# Altium project SoldeerStationProjectOntWerpen.PrjPcb
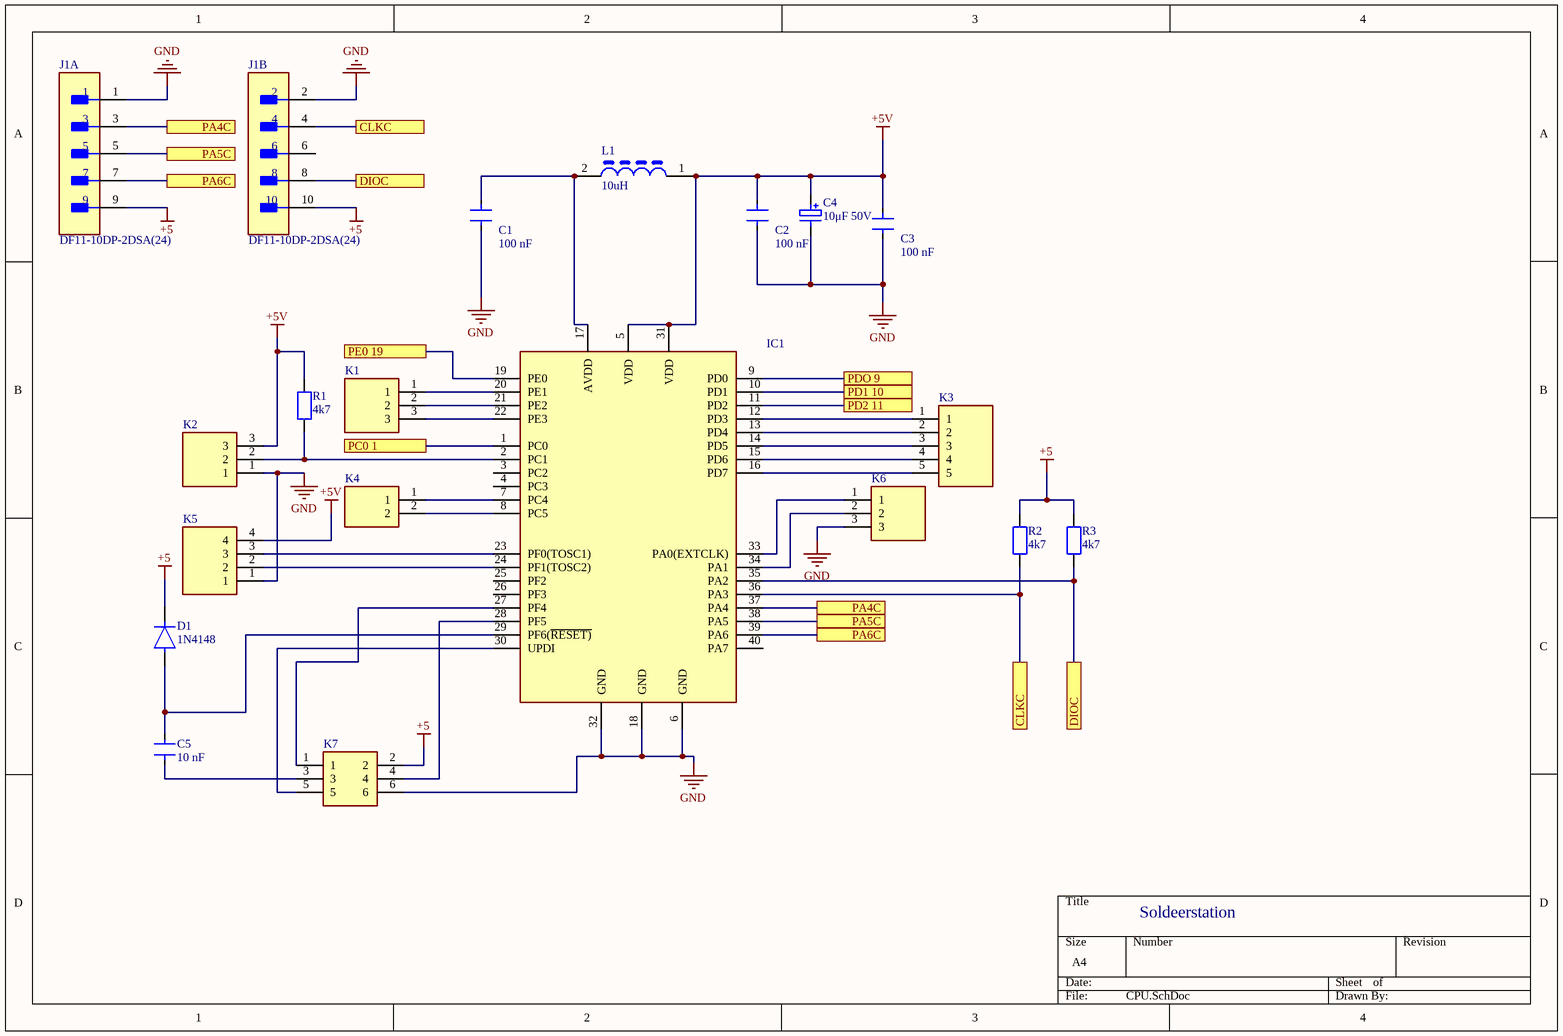
[diagram p0: CPU.SchDoc]
4 sheets, 69 parts. Net scope: flat (ports and power ports of the same name join across sheets).
Board file: PCB1.PcbDoc
Sheets:
  CPU.SchDoc
  Display.SchDoc
  Versterker.SchDoc
  Voeding.SchDoc

## Sheet CPU.SchDoc: Soldeerstation
size A4; Revision: 1; SheetNumber: 1; SheetTotal: 5

### Parts
C1  100 nF  [0805]
C2  100 nF  [0805]
C3  100 nF  [0805]
C4  10μF 50V  [Elco 10uF 50V]
C5  10 nF  [0805]
D1  1N4148  [1N4148]
IC1  ATMEGA4809-PF  [IC3]  (value not drawn)
J1  DF11-10DP-2DSA(24)  [FP-DF11-10DP-2DSA_24-MFG]  (parts A,B of 2)
K1  5-146280-3  [3 Pin Header]  (value not drawn)
K2  5-146280-3  [3 Pin Header]  (value not drawn)
K3  5-146280-5  [5 Pin Header]  (value not drawn)
K4  5-146280-2  [2 Pin Header]  (value not drawn)
K5  5-146280-4  [4 Pin Header]  (value not drawn)
K6  5-146280-3  [3 Pin Header]  (value not drawn)
K7  2x3 Pin Header  [2x3 Pin Header]  (value not drawn)
L1  10uH  [Smoorspoel]
R1  4k7  [Resistor]
R2  4k7  [Resistor]
R3  4k7  [Resistor]

### Ports
CLKC (see CPU[1A]), CLKC (see CPU[3C]), DIOC (see CPU[1A]), DIOC (see CPU[3C]), PA4C (see CPU[1A]), PA4C (see CPU[3C]), PA5C (see CPU[1A]), PA5C (see CPU[3C]), PA6C (see CPU[1A]), PA6C (see CPU[3C]), PC0 1 (see Regelaar[1B]), PD1 10 (see Versterker[1C]), PD2 11 (see Voeding[4B]), PDO 9 (see Versterker[1A]), PE0 19 (see Voeding[2B])

### Nets
+5: D1.1(C) J1.9 J1.10 K7.2 R2.2 R3.2
+5V: C2.1 C3.1 C4.1 IC1.5(VDD) IC1.31(VDD) K2.3 K5.4 L1.1 R1.2
GND: C1.2 C2.2 C3.2 C4.2 IC1.6(GND) IC1.18(GND) IC1.32(GND) J1.1 J1.2 K2.1 K5.1 K6.3 K7.6
NetC1_1: C1.1 IC1.17(AVDD) L1.2
NetC5_1: C5.1 K7.3
NetC5_2: C5.2 D1.2(A) IC1.29(PF6(~{RESET)})
NetC13_2: IC1.9(PD0) ; port PDO 9
NetC15_2: IC1.10(PD1) ; port PD1 10
NetIC1_1: IC1.1(PC0) ; port PC0 1
NetIC1_2: IC1.2(PC1) K2.2 R1.1
NetIC1_7: IC1.7(PC4) K4.1
NetIC1_8: IC1.8(PC5) K4.2
NetIC1_11: IC1.11(PD2) ; port PD2 11
NetIC1_12: IC1.12(PD3) K3.1
NetIC1_13: IC1.13(PD4) K3.2
NetIC1_14: IC1.14(PD5) K3.3
NetIC1_15: IC1.15(PD6) K3.4
NetIC1_16: IC1.16(PD7) K3.5
NetIC1_19: IC1.19(PE0) ; port PE0 19
NetIC1_20: IC1.20(PE1) K1.1
NetIC1_21: IC1.21(PE2) K1.2
NetIC1_22: IC1.22(PE3) K1.3
NetIC1_23: IC1.23(PF0(TOSC1)) K5.3
NetIC1_24: IC1.24(PF1(TOSC2)) K5.2
NetIC1_27: IC1.27(PF4) K7.1
NetIC1_28: IC1.28(PF5) K7.4
NetIC1_30: IC1.30(UPDI) K7.5
NetIC1_33: IC1.33(PA0(EXTCLK)) K6.1
NetIC1_34: IC1.34(PA1) K6.2
NetIC1_35: IC1.35(PA2) J1.8 R3.1 ; port DIOC
NetIC1_36: IC1.36(PA3) J1.4 R2.1 ; port CLKC
NetIC1_37: IC1.37(PA4) J1.3 ; port PA4C
NetIC1_38: IC1.38(PA5) J1.5 ; port PA5C
NetIC1_39: IC1.39(PA6) J1.7 ; port PA6C

Not connected (* = marked no-connect by the designer): IC1 3(PC2) 4(PC3) 25(PF2) 26(PF3) 40(PA7); J1 6

### Notes on the sheet
- Soldeerstation

### Library data of the parts
C1-C3 C5 = Condensator 0805: Chip Multilayer Ceramic Capacitors for General Purpose, 0805, 10uF, X5R, 15%, 10%, 25V; Length: 2mm; Depth: 1.25mm; Termination: SMD/SMT; Voltage: 25V; Height: 1.25mm; Material: Ceramic; Thickness: 0.053inch; Radiation Hardening: No; Min Operating Temperature: -55°C; Width: 0.049inch; Package Quantity: 1; Mount: Surface Mount; Dielectric: X5R; Packaging: Tape and Reel; Capacitance: 10uF; Voltage Rating (DC): 25V; Lead Free: Lead Free; Max Operating Temperature: 85°C; Case Code (Imperial): 0805; Case/Package: 0805; Tolerance: 10%; Voltage Rating: 25V; Case Code (Metric): 2012
C4 = Condensator Elco: Part Number: 02015A270JAT2A; Manufacturer: AVX Interconnect / Elco
D1 = 1N4148: 1N4148, 100 V, 200 mA, 4 ns; Reverse Voltage: 100V; Forward Voltage: 1V; Output Current: 200mA; Max Power Dissipation: 500mW; Max Reverse Current: 5uA; Forward Current: 300mA; Current: 4A; Reverse Recovery Time: 4ns; Element Configuration: Single; Outside Diameter: 1.85mm; Capacitance: 4pF; Polarity: Standard; Max Forward Surge Current (Ifsm): 1A; Average Rectified Current: 200mA; Diameter: 1.91mm; Max Repetitive Reverse Voltage (Vrrm): 100V; Current Rating: 200mA; Case/Package: DO-35; Lead Free: Lead Free; Number of Pins: 2; Recovery Time: 4ns; Packaging: Bulk; Contact Plating: Tin; Voltage: 100V; Mount: Through Hole; Max Surge Current: 4A; Package Quantity: 2000; Width: 1.91mm; Max Reverse Voltage (DC): 100V; Length: 4.56mm; Radiation Hardening: No; Power Dissipation: 500mW; Voltage Rating (DC): 100V; Peak Non-Repetitive Surge Current: 4A; REACH SVHC: No SVHC; Height: 4.56mm; Max Operating Temperature: 175°C; Series: -; Weight: 0.01lb; Min Operating Temperature: -65°C
IC1 = IC3: RoHS Compliant: Yes
J1 = CMP-11610-000008-1: CONN HEADER VERT 10POS 2MM; Manufacturer: Hirose; Number Of Contacts: 10; Voltage Rating: 250V; Conn Orientation: Straight; Conn Gender: Male; Current Rating: 2A; Temperature Range High: +85°C; RoHS: TRUE; Device Class L2: Headers and Wire Housings; ComponentLink2URL: https://www.hirose.com/product/document?clcode=CL0543-0520-0-24&productname=DF11-10DP-2DSA(24)&series=DF11&documenttype=Catalog&lang=en&documentid=D31688_en; Height: 6.9mm; Package: DF11-10DP-2DSA(24); ComponentLink2Description: Datasheet; Automotive: No; Digikey Description: CONN HEADER VERT 10POS 2MM; Manufacturer Part Number: DF11-10DP-2DSA(24); Temperature: -40°C to +85°C; Octopart: https://octopart.com/df11-10dp-2dsa%2824%29-hirose-39521433; Number Of Rows: 2; Device Class L3: unset; Contact Material: Tin,Nickel; Mouser Description: Headers & Wire Housings 10P STRT HEADER THRU HL,BD MNT,SN; Category: Conn; Device Class L1: Connectors; Temperature Range Low: -40°C; Pitch: 2mm; Lead Free: Yes; Footprint Url: https://www.hirose.com/product/document?clcode=CL0543-0520-0-24&productname=DF11-10DP-2DSA(24)&series=DF11&documenttype=2DDrawing&lang=en&documentid=0000995333
K1 K2 K6 = 3 Pin Header: Connector 5-146280-3; Manufacturer_Name: TE Connectivity; Datasheet Link: https://componentsearchengine.com//5-146280-3.pdf; Height: 8.21mm; Mouser2 Part Number: 571-5-146280-3; Mouser2 Price/Stock: https://www.mouser.com/Search/Refine.aspx?Keyword=571-5-146280-3; Manufacturer_Part_Number: 5-146280-3
K3 = 5 Pin Header: Connector 5-146280-5; Manufacturer_Name: TE Connectivity; Datasheet Link: https://componentsearchengine.com//5-146280-5.pdf; Height: 8.21mm; Mouser2 Part Number: 571-5-146280-5; Mouser2 Price/Stock: https://www.mouser.com/Search/Refine.aspx?Keyword=571-5-146280-5; Manufacturer_Part_Number: 5-146280-5
K4 = 2 Pin Header: Connector; Manufacturer_Name: TE Connectivity; Datasheet Link: http://www.te.com/commerce/DocumentDelivery/DDEController?Action=showdoc&DocId=Customer+Drawing%7F146280%7FH2%7Fpdf%7FEnglish%7FENG_CD_146280_H2.pdf%7F5-146280-2; Height: 8.72mm; Manufacturer_Part_Number: 5-146280-2
K5 = 4 Pin Header: Connector 5-146280-4; Manufacturer_Name: TE Connectivity; Datasheet Link: https://datasheet.datasheetarchive.com/originals/distributors/DKDS-20/396066.pdf; Height: 8.21mm; Manufacturer_Part_Number: 5-146280-4
K7 = 2x3 Pin Header: Connector; Manufacturer_Name: TE Connectivity; Manufacturer_Part_Number: 5-146256-3; Datasheet Link: https://www.te.com/commerce/DocumentDelivery/DDEController?Action=srchrtrv&DocNm=146256&DocType=Customer+Drawing&DocLang=English; Height: 8.72mm
L1 = Smoorspoel: Inductor VLS6045EX-100M-H; Manufacturer_Name: TDK; Datasheet Link: https://componentsearchengine.com//VLS6045EX-100M-H.pdf; Mouser2 Part Number: 810-VLS6045EX-100M-H; Mouser2 Price/Stock: https://www.mouser.com/Search/Refine.aspx?Keyword=810-VLS6045EX-100M-H; Manufacturer_Part_Number: VLS6045EX-100M-H
R1-R3 = Resistor: Manufacturer: Vishay Dale; Part Number: CRCW08050000Z0EA

## Sheet Display.SchDoc
size A4; SheetNumber: 2; SheetTotal: 5
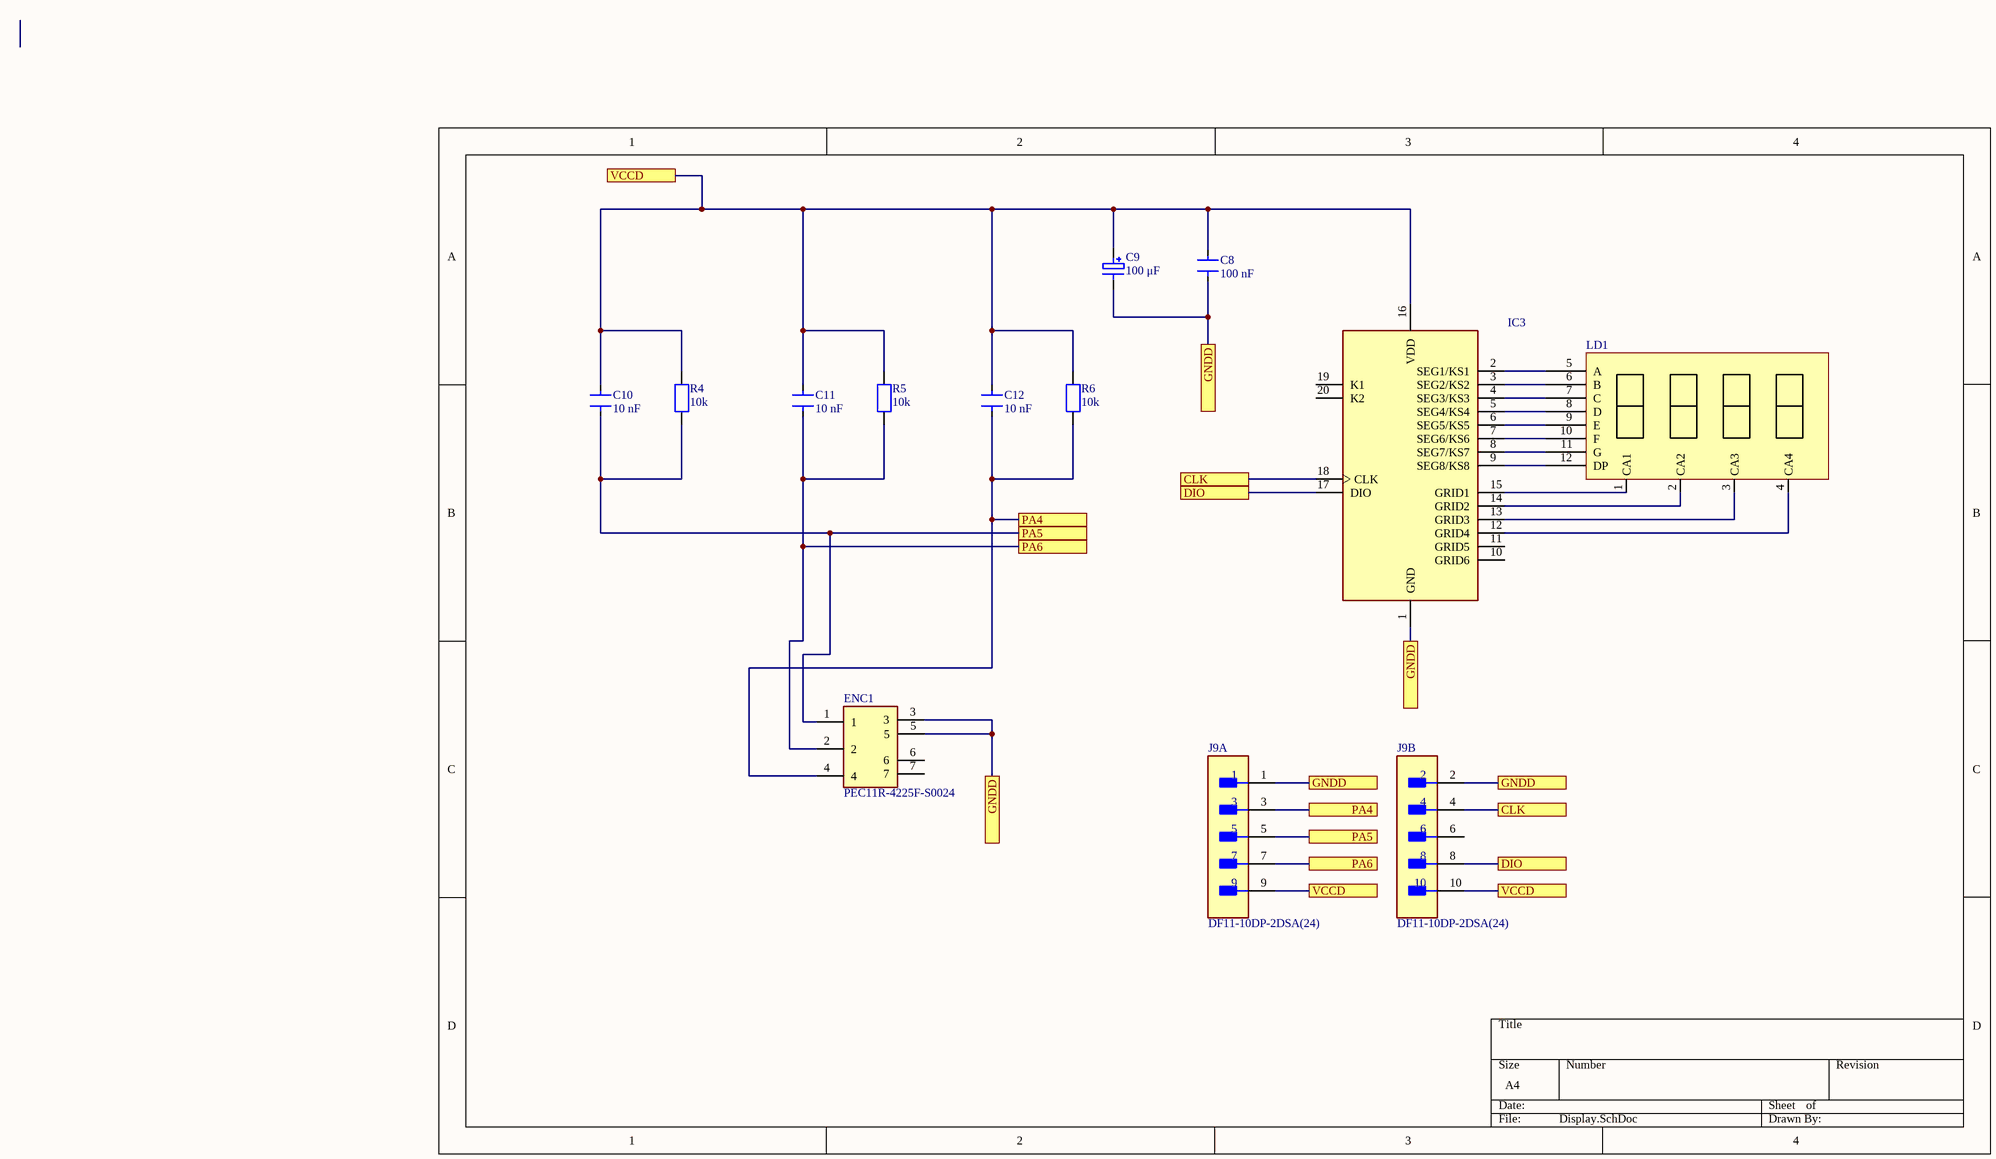
[diagram p1: Display.SchDoc]

### Parts
C8  100 nF  [0805]
C9  100 μF  [Elco 100uF 25V]
C10  10 nF  [0805]
C11  10 nF  [0805]
C12  10 nF  [0805]
ENC1  PEC11R-4225F-S0024  [Encoder]
IC3  TM1637  [TM1637]  (value not drawn)
J9  DF11-10DP-2DSA(24)  [FP-DF11-10DP-2DSA_24-MFG]  (parts A,B of 2)
LD1  7segment  [7segment]  (value not drawn)
R4  10k  [Resistor]
R5  10k  [Resistor]
R6  10k  [Resistor]

### Ports
CLK (see Display[2B]), CLK (see Display[3C]), DIO (see Display[2B]), DIO (see Display[3C]), GNDD (see Display[2B], Display[2C], Display[3C]), GNDD (see Display[2B], Display[3C]), GNDD (see Display[2C], Display[3C]), PA4 (see Display[2B]), PA4 (see Display[3C]), PA5 (see Display[2B]), PA5 (see Display[3C]), PA6 (see Display[2B]), PA6 (see Display[3C]), VCCD (see Display[1A], Display[3C]), VCCD (see Display[3C])

### Nets
NetC8_1: C8.1 C9.2 ENC1.3 ENC1.5 IC3.1(GND) J9.1 J9.2 ; port GNDD
NetC8_2: C8.2 C9.1 C10.2 C11.2 C12.2 IC3.16(VDD) J9.9 J9.10 R4.2 R5.2 R6.2 ; port VCCD
NetC10_1: C10.1 ENC1.1 J9.5 R4.1 ; port PA5
NetC11_1: C11.1 ENC1.2 J9.7 R5.1 ; port PA6
NetC12_1: C12.1 ENC1.4 J9.3 R6.1 ; port PA4
NetIC3_2: IC3.2(SEG1/KS1) LD1.5(A)
NetIC3_3: IC3.3(SEG2/KS2) LD1.6(B)
NetIC3_4: IC3.4(SEG3/KS3) LD1.7(C)
NetIC3_5: IC3.5(SEG4/KS4) LD1.8(D)
NetIC3_6: IC3.6(SEG5/KS5) LD1.9(E)
NetIC3_7: IC3.7(SEG6/KS6) LD1.10(F)
NetIC3_8: IC3.8(SEG7/KS7) LD1.11(G)
NetIC3_9: IC3.9(SEG8/KS8) LD1.12(DP)
NetIC3_12: IC3.12(GRID4) LD1.4(CA4)
NetIC3_13: IC3.13(GRID3) LD1.3(CA3)
NetIC3_14: IC3.14(GRID2) LD1.2(CA2)
NetIC3_15: IC3.15(GRID1) LD1.1(CA1)
NetIC3_17: IC3.17(DIO) J9.8 ; port DIO
NetIC3_18: IC3.18(CLK) J9.4 ; port CLK

Not connected (* = marked no-connect by the designer): ENC1 6 7; IC3 10(GRID6) 11(GRID5) 19(K1) 20(K2); J9 6

### Library data of the parts
C8 C10-C12 = Condensator 0805: as C1 on sheet CPU; Length: 2mm; Depth: 1.25mm; Termination: SMD/SMT; Voltage: 25V; Height: 1.25mm; Material: Ceramic; Thickness: 0.053inch; Radiation Hardening: No; Min Operating Temperature: -55°C; Width: 0.049inch; Package Quantity: 1; Mount: Surface Mount; Dielectric: X5R; Packaging: Tape and Reel; Capacitance: 10uF; Voltage Rating (DC): 25V; Lead Free: Lead Free; Max Operating Temperature: 85°C; Case Code (Imperial): 0805; Case/Package: 0805; Tolerance: 10%; Voltage Rating: 25V; Case Code (Metric): 2012
C9 = Condensator Elco: as C4 on sheet CPU
ENC1 = Encoder: Undefined or Miscellaneous; Manufacturer_Name: Bourns; Datasheet Link: https://componentsearchengine.com//PEC11R-4225F-S0024.pdf; Mouser2 Part Number: 652-PEC11R-4225F-S24; Mouser2 Price/Stock: https://www.mouser.com/Search/Refine.aspx?Keyword=652-PEC11R-4225F-S24; Manufacturer_Part_Number: PEC11R-4225F-S0024
IC3 = TM1637: LED Drive Control Special Circuit; MF: Titan Micro Electronics; Package: Package; Availability: Not in stock; SnapEDA_Link: https://www.snapeda.com/parts/TM1637/Titan+Micro+Electronics/view-part/?ref=snap; MP: TM1637; Check_prices: https://www.snapeda.com/parts/TM1637/Titan+Micro+Electronics/view-part/?ref=eda; Value: *; Price: None
J9 = CMP-11610-000008-1: as J1 on sheet CPU; Temperature Range High: +85°C; RoHS: TRUE; Device Class L2: Headers and Wire Housings; ComponentLink2URL: https://www.hirose.com/product/document?clcode=CL0543-0520-0-24&productname=DF11-10DP-2DSA(24)&series=DF11&documenttype=Catalog&lang=en&documentid=D31688_en; Height: 6.9mm; Package: DF11-10DP-2DSA(24); ComponentLink2Description: Datasheet; Automotive: No; Digikey Description: CONN HEADER VERT 10POS 2MM; Manufacturer Part Number: DF11-10DP-2DSA(24); Temperature: -40°C to +85°C; Octopart: https://octopart.com/df11-10dp-2dsa%2824%29-hirose-39521433; Number Of Rows: 2; Device Class L3: unset; Contact Material: Tin,Nickel; Mouser Description: Headers & Wire Housings 10P STRT HEADER THRU HL,BD MNT,SN; Category: Conn; Device Class L1: Connectors; Temperature Range Low: -40°C; Pitch: 2mm; Lead Free: Yes; Footprint Url: https://www.hirose.com/product/document?clcode=CL0543-0520-0-24&productname=DF11-10DP-2DSA(24)&series=DF11&documenttype=2DDrawing&lang=en&documentid=0000995333
R4-R6 = Resistor: as R1 on sheet CPU

## Sheet Versterker.SchDoc: Soldeerstation
size A4; SheetNumber: 3; SheetTotal: 5
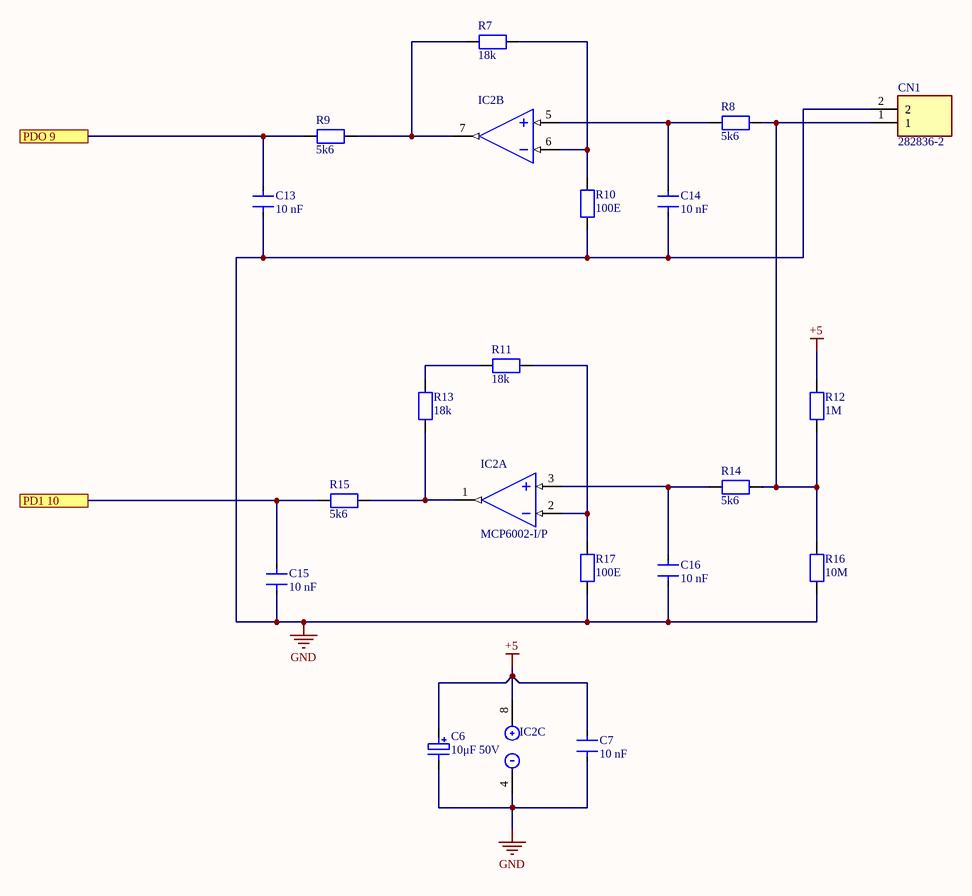
[diagram p2: Versterker.SchDoc]

### Parts
C6  10μF 50V  [Elco 10uF 50V]
C7  10 nF  [0805]
C13  10 nF  [0805]
C14  10 nF  [0805]
C15  10 nF  [0805]
C16  10 nF  [0805]
CN1  282836-2  [Schroefconnector 2 Pin]
IC2  MCP6002-I/P  [Opamp]  (parts A,B,C of 3)
R7  18k  [Resistor]
R8  5k6  [Resistor]
R9  5k6  [Resistor]
R10  100E  [Resistor]
R11  18k  [Resistor]
R12  1M  [Resistor]
R13  18k  [Resistor]
R14  5k6  [Resistor]
R15  5k6  [Resistor]
R16  10M  [Resistor]
R17  100E  [Resistor]

### Ports
PD1 10 (see CPU[3B]), PDO 9 (see CPU[3B])

### Nets
+5: C6.1 C7.2 IC2.8 R12.2
GND: C6.2 C7.1 C13.1 C14.1 C15.1 C16.1 CN1.2 IC2.4 R10.1 R16.1 R17.1
NetC13_2: C13.2 R9.1 ; port PDO 9
NetC14_2: C14.2 IC2.5 R8.1
NetC15_2: C15.2 R15.2 ; port PD1 10
NetC16_2: C16.2 IC2.3 R14.1
NetCN1_1: CN1.1 R8.2 R12.1 R14.2 R16.2
NetIC2_1: IC2.1 R13.1 R15.1
NetIC2_2: IC2.2 R11.2 R17.2
NetIC2_6: IC2.6 R7.2 R10.2
NetIC2_7: IC2.7 R7.1 R9.2
NetR11_1: R11.1 R13.2

### Library data of the parts
C6 = Condensator Elco: as C4 on sheet CPU
C7 C13-C16 = Condensator 0805: as C1 on sheet CPU; Length: 2mm; Depth: 1.25mm; Termination: SMD/SMT; Voltage: 25V; Height: 1.25mm; Material: Ceramic; Thickness: 0.053inch; Radiation Hardening: No; Min Operating Temperature: -55°C; Width: 0.049inch; Package Quantity: 1; Mount: Surface Mount; Dielectric: X5R; Packaging: Tape and Reel; Capacitance: 10uF; Voltage Rating (DC): 25V; Lead Free: Lead Free; Max Operating Temperature: 85°C; Case Code (Imperial): 0805; Case/Package: 0805; Tolerance: 10%; Voltage Rating: 25V; Case Code (Metric): 2012
CN1 = Schroefconnector 2 Pin L: Connector; Manufacturer_Name: TE Connectivity; Datasheet Link: https://www.te.com/commerce/DocumentDelivery/DDEController?Action=showdoc&DocId=Customer+Drawing%7F282836%7FJ%7Fpdf%7FEnglish%7FENG_CD_282836_J.pdf%7F282836-2; Height: 10mm; Manufacturer_Part_Number: 282836-2
IC2 = Opamp: AMP-OPA-MCP6002-IL8; Max Frequency: 1kHz; Operating Supply Current: 100uA; Amplifier Type: GENERAL PURPOSE; Number of Channels: 2; Power Supply Rejection Ratio (PSRR): 86dB; Max Input Voltage: 6V; Bandwidth: 1MHz; Voltage Gain: 112dB; Input Bias Current: 1pA; Slew Rate-Nom: 0.6V/µs; Output Current: 23mA; Input Offset Voltage-Max: 4.5mV; Common Mode Rejection Ratio: 60dB; Min Input Voltage: 1.8V; Operating Supply Voltage: 5.5V; Height: 0.195inch; Number of Circuits: 2; REACH SVHC: No SVHC; Max Supply Voltage: 6V; Supply Current: 100uA; Gain Bandwidth Product: 1MHz; Radiation Hardening: No; Mount: Through Hole; Length: 0.4inch; Number of Pins: 8; Min Operating Temperature: -40°C; Case/Package: PDIP; Number of Amplifiers: 2; RoHS Compliant: Yes; Lead Free: Lead Free; Number of Elements: 2; Technology: CMOS; Width: 0.28inch; Slew Rate: 0.6V/µs; Packaging: Rail/Tube; Output Current per Channel: 23mA; Max Operating Temperature: 85°C; Nominal Supply Current: 100uA; Min Supply Voltage: 1.8V; Input Offset Voltage (Vos): 4.5mV; Unity Gain Bandwidth Product: 1MHz; Package Quantity: 60
R7-R17 = Resistor: as R1 on sheet CPU

## Sheet Voeding.SchDoc
size A4; SheetNumber: 5; SheetTotal: 5
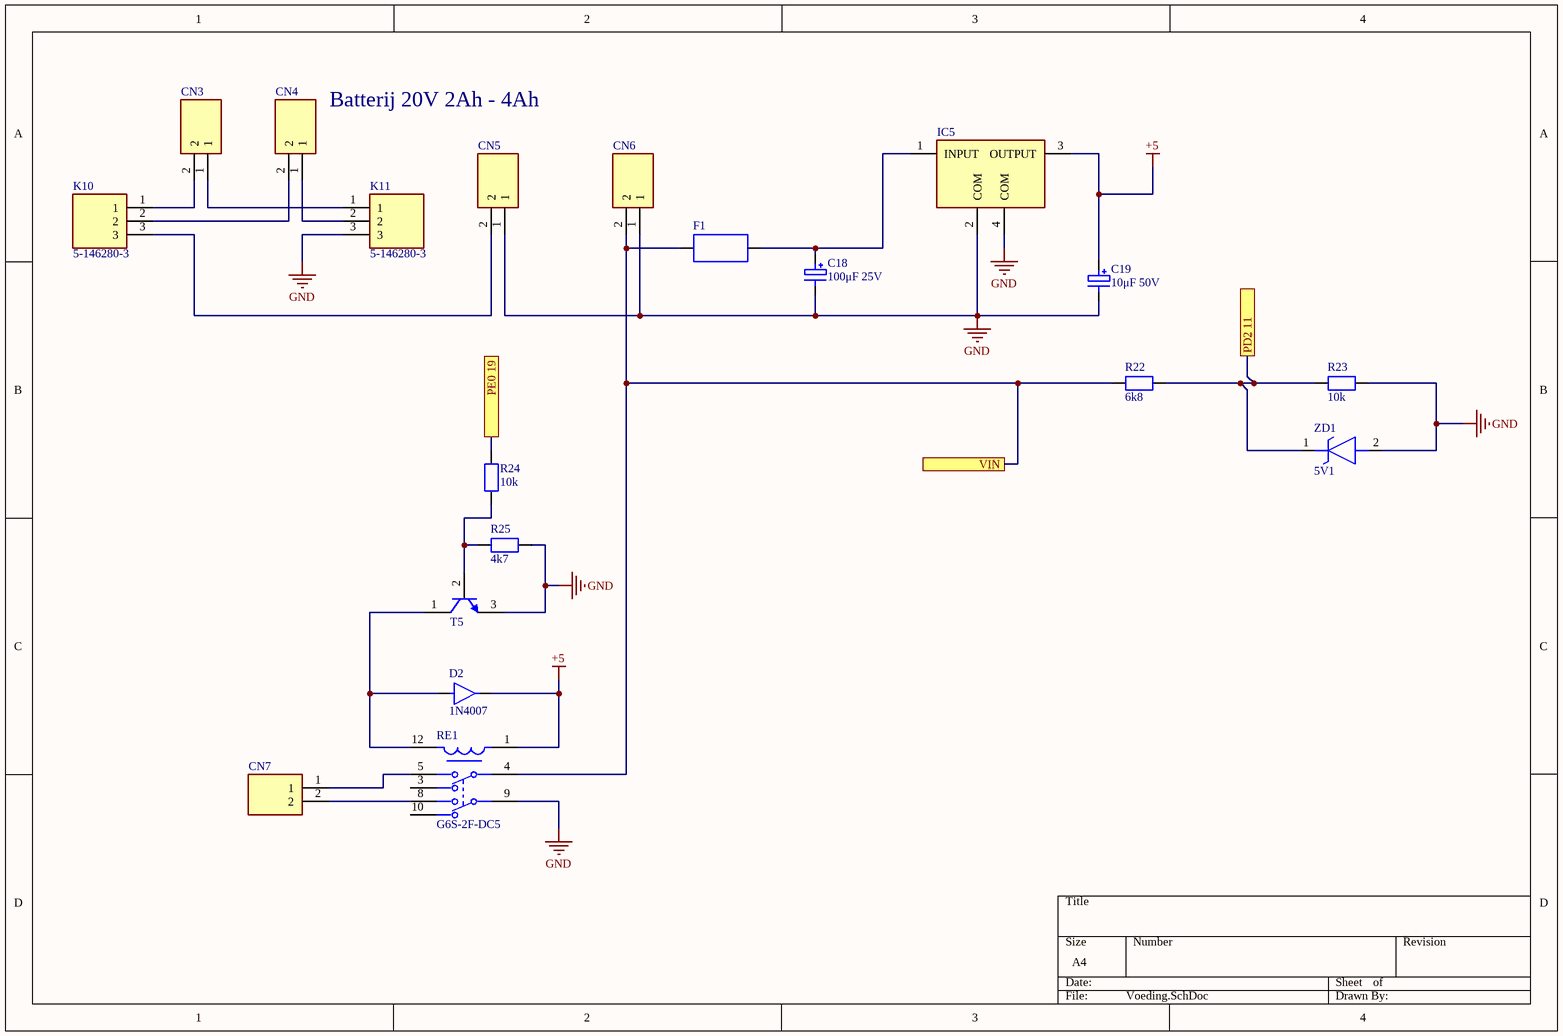
[diagram p3: Voeding.SchDoc]

### Parts
C18  100μF 25V  [Elco 100uF 25V]
C19  10μF 50V  [Elco 100uF 25V]
CN3  282836-2  [Schroefconnector 2 Pin]  (value not drawn)
CN4  282836-2  [Schroefconnector 2 Pin]  (value not drawn)
CN5  282836-2  [Schroefconnector 2 Pin]  (value not drawn)
CN6  282836-2  [Schroefconnector 2 Pin]  (value not drawn)
CN7  282836-2  [Schroefconnector 2 Pin]  (value not drawn)
D2  1N4007  [1N4007]
F1  696101000002  [FuseHolder]  (value not drawn)
IC5  TL780-05CKTTR  [DC-DC Convertor]  (value not drawn)
K10  5-146280-3  [3 Pin Header]
K11  5-146280-3  [3 Pin Header]
R22  6k8  [Resistor]
R23  10k  [Resistor]
R24  10k  [Resistor]
R25  4k7  [Resistor]
RE1  G6S-2F-DC5  [Relay]
T5  BC547CZL1G  [BC547C]  (value not drawn)
ZD1  5V1  [ZenerDiode]

### Ports
PD2 11 (see CPU[3B]), PE0 19 (see CPU[1B]), VIN (see Regelaar[2A])

### Nets
+5: C19.1 D2.1(C) IC5.3(OUTPUT) RE1.1
GND: C18.2 C19.2 CN5.1 CN6.1 IC5.2(COM) IC5.4(COM) K11.3 R23.2 R25.2 RE1.9 T5.3(E) ZD1.2(A)
NetC18_1: C18.1 F1.2 IC5.1(INPUT)
NetCN3_1: CN3.1 K11.1
NetCN3_2: CN3.2 K10.1
NetCN4_1: CN4.1 K11.2
NetCN4_2: CN4.2 K10.2
NetCN5_2: CN5.2 K10.3
NetCN6_2: CN6.2 F1.1 R22.1 RE1.4 ; port VIN
NetCN7_1: CN7.1 RE1.5
NetCN7_2: CN7.2 RE1.8
NetD2_2: D2.2(A) RE1.12 T5.1(C)
NetIC1_11: R22.2 R23.1 ZD1.1(K) ; port PD2 11
NetIC1_19: R24.2 ; port PE0 19
NetR24_1: R24.1 R25.1 T5.2(B)

Not connected (* = marked no-connect by the designer): RE1 3 10

### Notes on the sheet
- (near CN4) Batterij 20V 2Ah - 4Ah

### Library data of the parts
C18 C19 = Condensator Elco: as C4 on sheet CPU
CN3-CN7 = Schroefconnector 2 Pin L: as CN1 on sheet Versterker; Datasheet Link: https://www.te.com/commerce/DocumentDelivery/DDEController?Action=showdoc&DocId=Customer+Drawing%7F282836%7FJ%7Fpdf%7FEnglish%7FENG_CD_282836_J.pdf%7F282836-2; Height: 10mm; Manufacturer_Part_Number: 282836-2
D2 = 1N4007: 1000 V, 1 A; Reverse Voltage: 100V; Forward Voltage: 1V; Output Current: 200mA; Max Power Dissipation: 500mW; Max Reverse Current: 5uA; Forward Current: 300mA; Current: 4A; Reverse Recovery Time: 4ns; Element Configuration: Single; Outside Diameter: 1.85mm; Capacitance: 4pF; Polarity: Standard; Max Forward Surge Current (Ifsm): 1A; Average Rectified Current: 200mA; Diameter: 1.91mm; Max Repetitive Reverse Voltage (Vrrm): 100V; Current Rating: 200mA; Case/Package: DO-35; Lead Free: Lead Free; Number of Pins: 2; Recovery Time: 4ns; Packaging: Bulk; Contact Plating: Tin; Voltage: 100V; Mount: Through Hole; Max Surge Current: 4A; Package Quantity: 2000; Width: 1.91mm; Max Reverse Voltage (DC): 100V; Length: 4.56mm; Radiation Hardening: No; Power Dissipation: 500mW; Voltage Rating (DC): 100V; Peak Non-Repetitive Surge Current: 4A; REACH SVHC: No SVHC; Height: 4.56mm; Max Operating Temperature: 175°C; Series: -; Weight: 0.01lb; Min Operating Temperature: -65°C
F1 = FuseHolder: NexarPartId: 56808803; Fuse Current: 10A; Voltage Rating (AC): 250V; RoHS: Non-Compliant; Max Operating Temperature: 120°C; Min Operating Temperature: -30°C; Mount: Through Hole; Packaging: Box; Height: 13.6mm; REACH SVHC: Unknown
IC5 = DC/DC Convertor: IC REG LIN 5V 1.5A DDPAK/TO263-3; Max Input Voltage: 25V; Number of Outputs: 1; Dropout Voltage: 2V; Polarity: Positive; Output Type: Fixed; Quiescent Current: 8mA; Min Input Voltage: 7V; Power Supply Rejection Ratio (PSRR): 85dB; Accuracy: 1%; Lead Free: Lead Free; Min Operating Temperature: 0°C; Number of Pins: 3; Max Output Voltage: 5V; Case/Package: TO-263; Number of Regulators: 1; Packaging: Tape and Reel; Max Operating Temperature: 125°C; Max Output Current: 1.5A; Nominal Output Voltage: 5V; Height: 4.83mm; Mount: Surface Mount; Weight: 0.050897oz; Output Current: 1.5A; Width: 9.65mm; Output Voltage: 5V; Length: 10.67mm; REACH SVHC: No SVHC; Output Voltage Accuracy: 1%; Package Quantity: 1
K10 K11 = 3 Pin Header: as K1 on sheet CPU; Datasheet Link: https://componentsearchengine.com//5-146280-3.pdf; Height: 8.21mm; Mouser2 Part Number: 571-5-146280-3; Mouser2 Price/Stock: https://www.mouser.com/Search/Refine.aspx?Keyword=571-5-146280-3; Manufacturer_Part_Number: 5-146280-3
R22-R25 = Resistor: as R1 on sheet CPU
RE1 = Relay: RELAY TELECOM DPDT 2A 5VDC; Manufacturer: Omron; Coil Resistance: 178Ω; Coil Current: 28.1mA; Coil Voltage: 5V; Standoff Height: 0.35mm; Coil Power: 140mW; Coil Type: Non-Latching; Number Of Contacts: 2; RoHS: TRUE; Device Class L3: Signal Relays; Ambient Temperature Range Low: -40°C; Switching Current: 2A; Device Class L1: Electromechanical; Lead Free: Yes; Category: Relay; Digikey Description: RELAY TELECOM DPDT 2A 5VDC; Height: 9.4mm; Temperature: -40°C to +85°C; Throw Configuration: DPDT; Octopart: https://octopart.com/g6s-2f-dc5-omron-85236; Package: G6S-2F-DC5; Temperature Range High: +85°C; Automotive: No; Current Rating: 2A; Manufacturer Part Number: G6S-2F-DC5; Mouser Description: Electromechanical Relay 5VDC 178Ohm 2A DPDT (14.8x9.2x9.2)mm SMD Signal Relay; Temperature Range Low: -40°C; Device Class L2: Relays; Ambient Temperature Range High: +85°C; ComponentLink2URL: https://omronfs.omron.com/en_US/ecb/products/pdf/en-g6s.pdf; ComponentLink2Description: Datasheet
T5 = BC547C: BC547C, 45 V, 100 mA, 500 mW, / hfe = 400; Manufacturer: On Semiconductor; IC Continuous (A): 0.1; Packing: Ammo Box; Polarity: NPN; fT Min (MHz): 150; PackageDescription: 3-Pin Transistor Outline, Body 4.825 x 3.685 mm, Pitch 1.27 mm; ComponentLink2Description: Datasheet; PackageVersion: Rev. AM; DatasheetVersion: Rev. 7; Mounting Technology: Through Hole; ComponentLink3Description: Package Specification; PartNumber: BC547CZL1G; ComponentLink1Description: Manufacturer URL; PackageReference: TO-92-3-29-11_AM_BL; ComponentLink1URL: http://www.onsemi.com/; RoHS: TRUE; ComponentLink3URL: http://www.onsemi.com/pub_link/Collateral/MAC97-D.PDF; ComponentLink2URL: http://www.onsemi.com/pub_link/Collateral/BC546-D.PDF
ZD1 = ZenerDiode: zenerdiode 5,1 V, 500 mW

## Nets that join several sheets
+5: CPU (6 pins), Versterker (C6.1 C7.2 IC2.8 R12.2), Voeding (C19.1 D2.1 IC5.3 RE1.1)
GND: CPU (13 pins), Versterker (11 pins), Voeding (12 pins)
NetC13_2: CPU (IC1.9), Versterker (C13.2 R9.1)
NetC15_2: CPU (IC1.10), Versterker (C15.2 R15.2)
NetIC1_11: CPU (IC1.11), Voeding (R22.2 R23.1 ZD1.1)
NetIC1_19: CPU (IC1.19), Voeding (R24.2)